# Altium schematic sheet schematic.schdoc
size A3
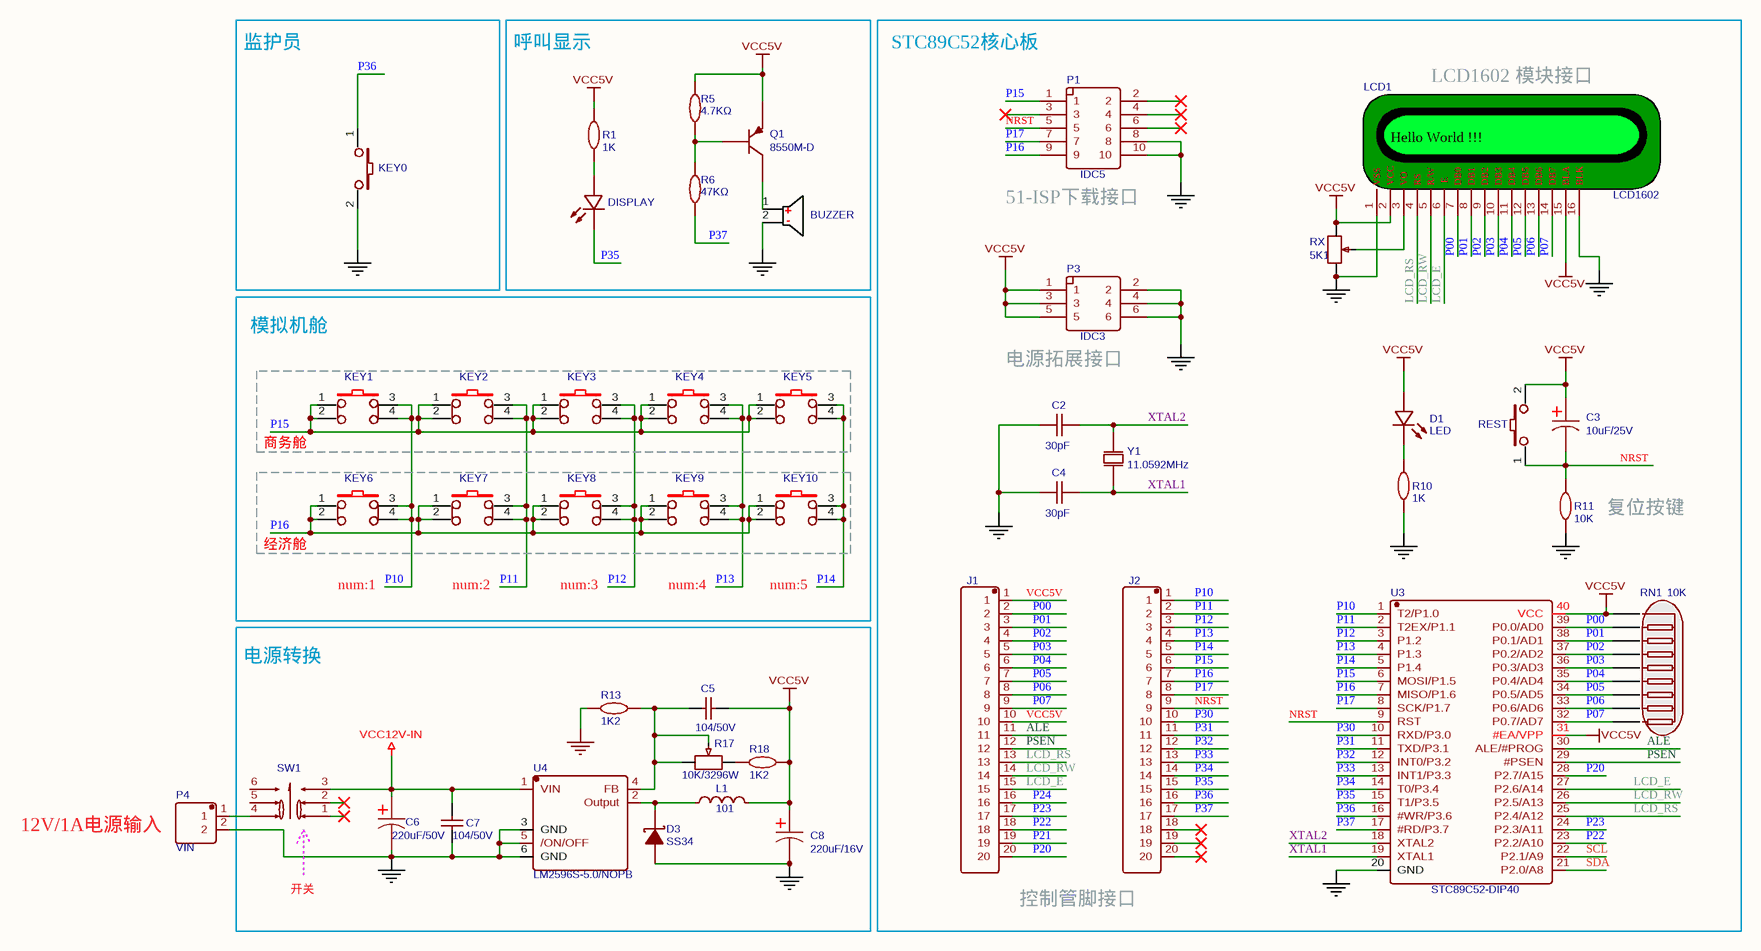
[diagram p0: schematic.schdoc]

## Parts
BUZZER  C194267  [BEEP-TH_BD9.1-P5.00-D0.6-L-FD]  (value not drawn)
C2  30pF  [C0805]
C3  10uF/25V  [RAD6.3]
C4  30pF  [C0805]
C5  104/50V  [C_0805]
C6  220uF/50V  [RAD6.3]
C7  104/50V  [C_0805]
C8  220uF/16V  [CASE-B_3528]
D1  LED  [LED-0805]
D3  SS34  [DO-214AC]
DISPLAY  HQ17-2102UWC  [LED0805-RD]  (value not drawn)
J1  220S-1*20P H=8.5MM Ytype Gold-plated  [HDR-TH_20P-P2.54-V]  (value not drawn)
J2  220S-1*20P H=8.5MM Ytype Gold-plated  [HDR-TH_20P-P2.54-V]  (value not drawn)
KEY0  Switch3x4x2  [KEY-3.0*4.0]  (value not drawn)
KEY1  12*12*5.5  [KEY-12*12-2]  (value not drawn)
KEY2  12*12*5.5  [KEY-12*12-2]  (value not drawn)
KEY3  12*12*5.5  [KEY-12*12-2]  (value not drawn)
KEY4  12*12*5.5  [KEY-12*12-2]  (value not drawn)
KEY5  12*12*5.5  [KEY-12*12-2]  (value not drawn)
KEY6  12*12*5.5  [KEY-12*12-2]  (value not drawn)
KEY7  12*12*5.5  [KEY-12*12-2]  (value not drawn)
KEY8  12*12*5.5  [KEY-12*12-2]  (value not drawn)
KEY9  12*12*5.5  [KEY-12*12-2]  (value not drawn)
KEY10  12*12*5.5  [KEY-12*12-2]  (value not drawn)
L1  101  [L-101-3A-SWB]
LCD1  LCD1602  [LCD1602]
P1  IDC5  [IDC-TH_Z-231012810106]
P3  IDC3  [IDC-TH_6P-P2.54_300R-6P]
P4  VIN  [WJ2EDGR-5.08-2P]
Q1  8550M-D  [SOT-23-3]
R1  1K  [R0805]
R5  4.7KΩ  [0805_R]
R6  47KΩ  [0805_R]
R10  1K  [R0805]
R11  10K  [R0805]
R13  1K2  [R_0805]
R17  10K/3296W  [RES-ADJ_3296W]
R18  1K2  [R_0805]
REST  Switch3x4x2  [KEY-3.0*4.0]  (value not drawn)
RN1  10K  [RES-ARRAY-TH_9P-P2.54-D1.0]
RX  5K1  [RES-ADJ-SMD_EVM3ESX50B24]
SW1  K8  [SW-TH_6P-L5.8-W5.8-P2.00-LS4.5-BL]  (value not drawn)
U3  STC89C52-DIP40  [DIP-40_L52.3-W13.9-P2.54-LS15.2-BL]
U4  LM2596S-5.0/NOPB  [TO-263-5]
Y1  11.0592MHz  [HC-49S_L11.0-W4.6-P4.88]

## Blocks framed on the sheet
监护员: KEY0
呼叫显示: BUZZER DISPLAY Q1 R1 R5 R6
商务舱: KEY1-KEY5
经济舱: KEY6-KEY10
电源转换: C5-C8 D3 L1 R13 R17 R18 SW1 U4

## Nets
GND: BUZZER.2 C2.1 C4.1 C6.2 C7.2 C8.2 D3.1(A) KEY0.2 LCD1.1(VSS) LCD1.16(BLK) P1.8 P1.10 P3.2 P3.4 P3.6 P4.2 R10.1 R11.1 R13.2 RX.1 U3.20(GND) U4.3(GND) U4.5(/ON/OFF) U4.6(GND)
VCC5V: C3.1 C5.2 C8.1 D1.1(A) J1.1 J1.10 L1.2 LCD1.2(VCC) LCD1.15(BLA) P3.1 P3.3 P3.5 Q1.2(E) R1.2 R5.2 R18.1 REST.2 RN1.1 RX.3 U3.31(#EA/VPP) U3.40(VCC)
VCC12V-IN: C6.1 C7.1 SW1.3 U4.1(VIN)
ALE: J1.11 U3.30(ALE/#PROG)
LCD_E: J1.15 LCD1.6(E) U3.27(P2.6/A14)
LCD_RS: J1.13 LCD1.4(RS) U3.25(P2.4/A12)
LCD_RW: J1.14 LCD1.5(R/W) U3.26(P2.5/A13)
NRST: C3.2 J2.9 P1.5 R11.2 REST.1 U3.9(RST)
P00: J1.2 LCD1.7(DB0) RN1.2 U3.39(P0.0/AD0)
P01: J1.3 LCD1.8(DB1) RN1.3 U3.38(P0.1/AD1)
P02: J1.4 LCD1.9(DB2) RN1.4 U3.37(P0.2/AD2)
P03: J1.5 LCD1.10(DB3) RN1.5 U3.36(P0.3/AD3)
P04: J1.6 LCD1.11(DB4) RN1.6 U3.35(P0.4/AD4)
P05: J1.7 LCD1.12(DB5) RN1.7 U3.34(P0.5/AD5)
P06: J1.8 LCD1.13(DB6) RN1.8 U3.33(P0.6/AD6)
P07: J1.9 LCD1.14(DB7) RN1.9 U3.32(P0.7/AD7)
P10: J2.1 KEY1.3 KEY1.4 KEY6.3 KEY6.4 U3.1(T2/P1.0)
P11: J2.2 KEY2.3 KEY2.4 KEY7.3 KEY7.4 U3.2(T2EX/P1.1)
P12: J2.3 KEY3.3 KEY3.4 KEY8.3 KEY8.4 U3.3(P1.2)
P13: J2.4 KEY4.3 KEY4.4 KEY9.3 KEY9.4 U3.4(P1.3)
P14: J2.5 KEY5.3 KEY5.4 KEY10.3 KEY10.4 U3.5(P1.4)
P15: J2.6 KEY1.1 KEY1.2 KEY2.1 KEY2.2 KEY3.1 KEY3.2 KEY4.1 KEY4.2 KEY5.1 KEY5.2 P1.1 U3.6(MOSI/P1.5)
P16: J2.7 KEY6.1 KEY6.2 KEY7.1 KEY7.2 KEY8.1 KEY8.2 KEY9.1 KEY9.2 KEY10.1 KEY10.2 P1.9 U3.7(MISO/P1.6)
P17: J2.8 P1.7 U3.8(SCK/P1.7)
P20: J1.20 U3.28(P2.7/A15)
P21: J1.19
P22: J1.18 U3.23(P2.2/A10)
P23: J1.17 U3.24(P2.3/A11)
P24: J1.16
P30: J2.10 U3.10(RXD/P3.0)
P31: J2.11 U3.11(TXD/P3.1)
P32: J2.12 U3.12(INT0/P3.2)
P33: J2.13 U3.13(INT1/P3.3)
P34: J2.14 U3.14(T0/P3.4)
P35: DISPLAY.1(K) J2.15 U3.15(T1/P3.5)
P36: J2.16 KEY0.1 U3.16(#WR/P3.6)
P37: J2.17 R6.1 U3.17(#RD/P3.7)
PSEN: J1.12 U3.29(#PSEN)
SCL: U3.22(P2.1/A9)
SDA: U3.21(P2.0/A8)
XTAL1: C4.2 U3.19(XTAL1) Y1.1(OSC1)
XTAL2: C2.2 U3.18(XTAL2) Y1.2(OSC2)
NetBUZZER_1: BUZZER.1 Q1.3(C)
NetC5_1: C5.1 R13.1 R17.2 R17.3 U4.4(FB)
NetD1_2: D1.2(K) R10.2
NetD3_2: D3.2(K) L1.1 U4.2(Output)
NetDISPLAY_2: DISPLAY.2(A) R1.1
NetLCD1_3: LCD1.3(VO) RX.2
NetP4_1: P4.1 SW1.4
NetQ1_1: Q1.1(B) R5.1 R6.2
NetR17_1: R17.1 R18.2

Not connected (* = marked no-connect by the designer): J2 18* 19* 20*; P1 2* 3* 4* 6*; SW1 1* 2* 5 6

## Notes on the sheet
- STC89C52核心板
- LCD1602 模块接口
- (near P1) 51-ISP下载接口
- 模拟机舱
- (near P3) 电源拓展接口
- (near R11) 复位按键
- num:1
- num:2
- num:3
- num:4
- num:5
- 12V/1A电源输入
- 开关
- (near J1) 控制管脚接口
- (in symbol LCD1602) Hello World !!!

## Library data of the parts
BUZZER = C194267: BOM_Manufacturer: Changzhou Chaoyin Elec; Contributor: LCSC; BOM_Paste Type: expand; BOM_Supplier: LCSC; BOM_Supplier Part: C194267; BOM_Manufacturer Part: C194267; spicePre: B; spiceSymbolName: C194267
C2 C4 = 22pF: BOM_Manufacturer: WTC; BOM_Manufacturer Part: 0805N220J500; nameAlias: Capacitance; Contributor: LCSC; BOM_Supplier: LCSC; BOM_Supplier Part: C123642; spicePre: C; spiceSymbolName: 0805N220J500
C3 C6 C8 = 100uF: BOM_Manufacturer: Shenzhen Zhenhua XinYun Elec; BOM_Manufacturer Part: CA45-B-10V-100uF-M; nameAlias: Capacitance; Contributor: LCSC; BOM_Supplier: LCSC; BOM_Supplier Part: C140381; BOM_LCSC Assembly: Yes; spicePre: C; spiceSymbolName: CA45-B-10V-100UF-M
C5 C7 = 100nF: BOM_Manufacturer: FH; BOM_Manufacturer Part: 0805F104M500NT; nameAlias: Capacitance; Contributor: MrWangs; BOM_Supplier: LCSC; BOM_Supplier Part: C28378; spicePre: C; spiceSymbolName: 0805500NT
D1 = LEDSMD: BOM_Manufacturer: KENTO; BOM_Manufacturer Part: whiteLEDSMD; SMT Type: Basic; BOM_Supplier: LCSC; BOM_LCSC Assembly: Yes; image: //image.lceda.cn/szlcsc/C34499.jpg; BOM_Supplier Part: C34499; spicePre: L; spiceSymbolName: whiteLEDSMD
D3 = SS34_C266553: BOM_Manufacturer: Bourne Semicon (Shenzhen); Contributor: LCSC; BOM_Supplier: LCSC; BOM_Supplier Part: C266553; BOM_Manufacturer Part: SS34; BOM_LCSC Assembly: Yes; spicePre: D
DISPLAY = HQ17-2102UWC: BOM_Manufacturer: HARVATEK; Contributor: LCSC; BOM_Supplier: LCSC; BOM_Manufacturer Part: HQ17-2102UWC; BOM_Supplier Part: C154480; spicePre: L; spiceSymbolName: HQ17-2102UWC
J1 J2 = 220S-1*20P H=8.5MM Ytype Gold-plated: BOM_Manufacturer: Ckmtw; Contributor: LCSC; BOM_Supplier: LCSC; BOM_Manufacturer Part: 220S-1*20P H=8.5MM Ytype Gold-plated; BOM_Supplier Part: C124410; spicePre: H; spiceSymbolName: 220S-1*20P H=8.5MM Ytype Gold-plated
KEY0 REST = Switch3x4x2: BOM_Manufacturer: ReliaPro; BOM_Supplier: LCSC; BOM_Manufacturer Part: Switch3x4x2; BOM_Supplier Part: C26638; spicePre: K; spiceSymbolName: Switch3x4x2
KEY1-KEY10 = 12*12*5.5: BOM_Manufacturer: ReliaPro; BOM_Supplier Part: C58359; BOM_Supplier: LCSC; BOM_Manufacturer Part: 12*12*5.5; spicePre: K; spiceSymbolName: 12*12*5.5
L1 = BLM18RK102SN1D: BOM_Manufacturer: MuRata; nameAlias: Value(H); Value: 1KΩ; BOM_Supplier: LCSC; BOM_Manufacturer Part: BLM18RK102SN1D; BOM_Supplier Part: C88986; spicePre: L; spiceSymbolName: BLM18RK102SN1D
LCD1 = LCD1602: BOM_Manufacturer Part: LCM1602K-NSW-BBW; Contributor: whwqm; BOM_Supplier Part: C83275; BOM_Supplier: LCSC; spicePre: L; spiceSymbolName: LCD1602
P1 = Z-231012810106: BOM_Manufacturer: ZHENGLING; BOM_Paste Type: expand; BOM_Supplier: LCSC; BOM_Manufacturer Part: Z-231012810106; BOM_Supplier Part: C93705; spicePre: C; spiceSymbolName: Z-231012810106
P3 = 300R-6P: BOM_Manufacturer: Ckmtw; Contributor: LCSC; BOM_Paste Type: expand; BOM_Supplier: LCSC; BOM_Manufacturer Part: 300R-6P; BOM_Supplier Part: C146629; spicePre: C; spiceSymbolName: 300R-6P
P4 = WJ2EDGRC-5.08-2P: BOM_Manufacturer: Amphenol ICC; BOM_Manufacturer Part: 68000-102HLF; Contributor: LCSC; BOM_Supplier: LCSC; BOM_Supplier Part: C168673; spicePre: H
Q1 = 8550M-D: BOM_Manufacturer: BLUE ROCKET; Contributor: LCSC; SMT Type: Extend; BOM_Supplier: LCSC; BOM_Supplier Part: C305456; BOM_Manufacturer Part: 8550M-D; BOM_LCSC Assembly: Yes; spicePre: Q
R1 R10 = 1K: BOM_Manufacturer: KOA; BOM_Manufacturer Part: RK73H2ATTD1001F; nameAlias: Resistance (Ohms); Contributor: LCSC; BOM_Supplier: LCSC; BOM_Supplier Part: C160065; spicePre: R; spiceSymbolName: RK73H2ATTD1001F
R5 R6 = 100: BOM_Manufacturer: Stackpole Elec; BOM_Manufacturer Part: RMCF0805FT100R; nameAlias: Resistance (Ohms); Contributor: MrWangs; BOM_Supplier: LCSC; BOM_Supplier Part: C237122; spicePre: R; spiceSymbolName: RMCF0805FT
R11 = 10K: BOM_Manufacturer: KAMAYA; BOM_Manufacturer Part: RMC1/10K203FTP; nameAlias: Resistance (Ohms); Contributor: LCSC; BOM_Supplier: LCSC; BOM_Supplier Part: C340510; spicePre: R; spiceSymbolName: RMC1/10K203FTP
R13 R18 = R_0805: BOM_Manufacturer: Stackpole Elec; BOM_Manufacturer Part: RMCF0805FT100R; nameAlias: Resistance (Ohms); Contributor: MrWangs; BOM_Supplier: LCSC; BOM_Supplier Part: C237122; spicePre: R; spiceSymbolName: RMCF0805FT
R17 = 50: BOM_Manufacturer: BOURNS; BOM_Manufacturer Part: 3296W-1-500LF; nameAlias: Resistance(Ohms); BOM_Supplier: LCSC; BOM_Supplier Part: C83692; spicePre: R; spiceSymbolName: 3296W-1-500LF
RN1 = 120: BOM_Manufacturer: FH; BOM_Manufacturer Part: A09-121JP; nameAlias: Resistance (Ohms); BOM_Supplier: LCSC; BOM_Supplier Part: C9110; spicePre: R; spiceSymbolName: A09-121JP
RX = (no symbol name): BOM_Manufacturer: PANASONIC; BOM_Manufacturer Part: EVM3ESX50BY3; nameAlias: Value; BOM_Supplier: LCSC; BOM_Supplier Part: C11964; spicePre: R; spiceSymbolName: EVM3ESX50BY3
SW1 = K8-5851E-N1_C134191: BOM_Manufacturer: HRO; Contributor: LCSC; BOM_Paste Type: expand; BOM_Supplier: LCSC; BOM_Manufacturer Part: K8-5851E-N1; BOM_Supplier Part: C134191; spicePre: S; spiceSymbolName: K8-5851E-N1_C134191
U3 = AT89S52-24PU: BOM_Manufacturer: MICROCHIP; spicePre: X; BOM_Supplier: LCSC; BOM_Manufacturer Part: AT89S52-24PU; image: //image.lceda.cn/szlcsc/C9441.jpg; BOM_Supplier Part: C9441; spiceSymbolName: AT89S52-24PU
U4 = LM2596S-5.0/NOPB: BOM_Manufacturer: Texas Instruments; Contributor: LCSC; BOM_Supplier: LCSC; BOM_Supplier Part: C116713; BOM_Manufacturer Part: LM2596S-5.0/NOPB; spicePre: U
Y1 = 8MHZ: BOM_Manufacturer: JGHC; BOM_Manufacturer Part: 49SAC08000182060; nameAlias: Value; Contributor: LCSC; BOM_Supplier: LCSC; BOM_Supplier Part: C390747; spicePre: X; spiceSymbolName: 49SAC08000182060